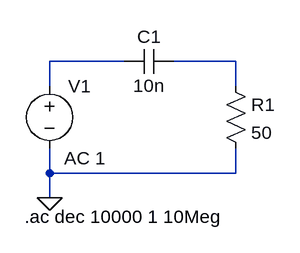
[diagram p0: schematic Circuito3.asc]
Circuito3.asc, the LTspice schematic file:
Version 4
SHEET 1 880 680
WIRE 128 80 32 80
WIRE 272 80 192 80
WIRE 32 112 32 80
WIRE 272 112 272 80
WIRE 32 224 32 192
WIRE 272 224 272 192
WIRE 272 224 32 224
WIRE 32 256 32 224
FLAG 32 256 0
SYMBOL voltage 32 96 R0
WINDOW 123 19 109 Left 2
WINDOW 39 0 0 Left 0
SYMATTR Value2 AC 1
SYMATTR InstName V1
SYMATTR Value ""
SYMBOL cap 192 64 R90
WINDOW 0 0 32 VBottom 2
WINDOW 3 32 32 VTop 2
SYMATTR InstName C1
SYMATTR Value 10n
SYMBOL res 256 96 R0
SYMATTR InstName R1
SYMATTR Value 50
TEXT 0 280 Left 2 !.ac dec 10000 1 10Meg

The netlist it stands for:
* Circuito3.asc
V1 N001 0 AC 1
C1 N002 N001 10n
R1 N002 0 50
.ac dec 10000 1 10Meg
.backanno
.end